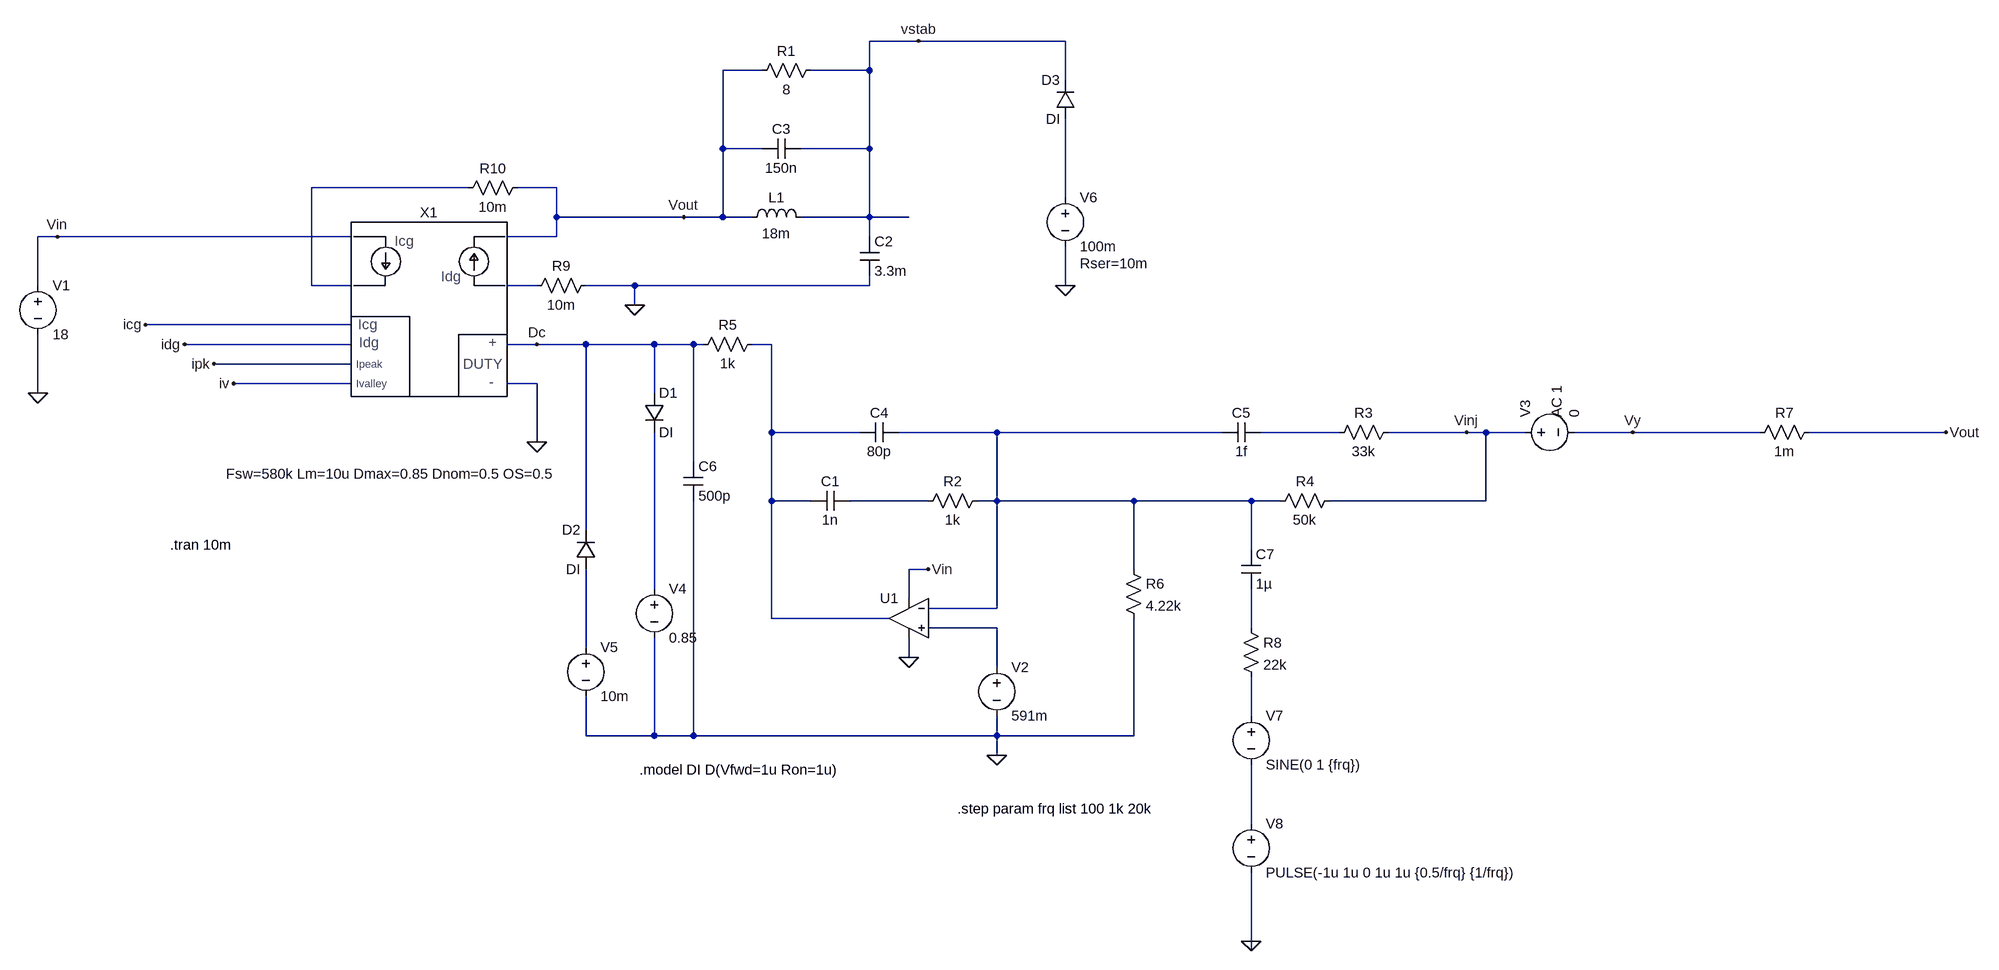
[diagram p0: schematic TPS40195_Power_Amp_Trans.asc]
TPS40195_Power_Amp_Trans.asc, the LTspice schematic file:
Version 4
SHEET 1 2744 1236
WIRE 992 -256 912 -256
WIRE 1232 -256 992 -256
WIRE 736 -208 672 -208
WIRE 912 -208 912 -256
WIRE 912 -208 816 -208
WIRE 1232 -192 1232 -256
WIRE 672 -80 672 -208
WIRE 736 -80 672 -80
WIRE 912 -80 912 -208
WIRE 912 -80 800 -80
WIRE 256 -16 0 -16
WIRE 400 -16 336 -16
WIRE 1232 0 1232 -128
WIRE 400 32 400 -16
WIRE 608 32 400 32
WIRE 672 32 672 -80
WIRE 672 32 608 32
WIRE 720 32 672 32
WIRE 912 32 912 -80
WIRE 912 32 800 32
WIRE 976 32 912 32
WIRE -416 64 -448 64
WIRE 64 64 -416 64
WIRE 400 64 400 32
WIRE 400 64 320 64
WIRE 912 64 912 32
WIRE -448 144 -448 64
WIRE 0 144 0 -16
WIRE 64 144 0 144
WIRE 368 144 320 144
WIRE 528 144 448 144
WIRE 912 144 912 128
WIRE 912 144 528 144
WIRE 1232 144 1232 80
WIRE 528 176 528 144
WIRE 64 208 -272 208
WIRE 64 240 -208 240
WIRE 368 240 320 240
WIRE 448 240 368 240
WIRE 560 240 448 240
WIRE 624 240 560 240
WIRE 640 240 624 240
WIRE 752 240 720 240
WIRE 64 272 -160 272
WIRE 64 304 -128 304
WIRE 368 304 320 304
WIRE -448 320 -448 224
WIRE 560 320 560 240
WIRE 752 384 752 240
WIRE 896 384 752 384
WIRE 1120 384 960 384
WIRE 1488 384 1120 384
WIRE 1680 384 1552 384
WIRE 1888 384 1760 384
WIRE 1920 384 1888 384
WIRE 1984 384 1920 384
WIRE 2160 384 2064 384
WIRE 2368 384 2160 384
WIRE 2672 384 2448 384
WIRE 368 400 368 304
WIRE 624 432 624 240
WIRE 752 496 752 384
WIRE 816 496 752 496
WIRE 1008 496 880 496
WIRE 1120 496 1120 384
WIRE 1120 496 1088 496
WIRE 1344 496 1120 496
WIRE 1536 496 1344 496
WIRE 1584 496 1536 496
WIRE 1920 496 1920 384
WIRE 1920 496 1664 496
WIRE 448 544 448 240
WIRE 1536 576 1536 496
WIRE 1008 608 976 608
WIRE 1344 608 1344 496
WIRE 560 640 560 384
WIRE 976 656 976 608
WIRE 1120 672 1120 496
WIRE 1120 672 1008 672
WIRE 752 688 752 496
WIRE 944 688 752 688
WIRE 1120 704 1008 704
WIRE 1536 704 1536 640
WIRE 448 736 448 608
WIRE 976 752 976 720
WIRE 1120 768 1120 704
WIRE 1536 848 1536 784
WIRE 448 880 448 816
WIRE 560 880 560 720
WIRE 560 880 448 880
WIRE 624 880 624 496
WIRE 624 880 560 880
WIRE 1120 880 1120 848
WIRE 1120 880 624 880
WIRE 1344 880 1344 688
WIRE 1344 880 1120 880
WIRE 1120 912 1120 880
WIRE 1536 1024 1536 928
WIRE 1536 1216 1536 1104
WIRE 1536 1232 1536 1216
FLAG 528 176 0
FLAG -448 320 0
FLAG 608 32 Vout
FLAG -416 64 Vin
FLAG 368 240 Dc
FLAG -272 208 icg
FLAG -208 240 idg
FLAG -160 272 ipk
FLAG -128 304 iv
FLAG 368 400 0
FLAG 976 752 0
FLAG 1008 608 Vin
FLAG 1120 912 0
FLAG 2672 384 Vout
FLAG 1888 384 Vinj
FLAG 1232 144 0
FLAG 2160 384 Vy
FLAG 1536 1216 0
FLAG 992 -256 vstab
DATAFLAG -208 208 ""
DATAFLAG -112 240 ""
DATAFLAG -112 272 ""
DATAFLAG -32 304 ""
DATAFLAG 464 32 ""
DATAFLAG 976 32 ""
DATAFLAG 480 240 ""
DATAFLAG 1200 384 ""
DATAFLAG 784 384 ""
SYMBOL voltage -448 128 R0
WINDOW 123 0 0 Left 0
WINDOW 39 0 0 Left 0
SYMATTR InstName V1
SYMATTR Value 18
SYMBOL Duty_Control_IRM 192 144 R0
WINDOW 39 -332 308 Left 2
SYMATTR SpiceLine Fsw=580k Lm=10u Dmax=0.85 Dnom=0.5 OS=0.5
SYMATTR InstName X1
SYMBOL ind 704 48 R270
WINDOW 0 32 56 VTop 2
WINDOW 3 5 56 VBottom 2
SYMATTR InstName L1
SYMATTR Value 18m
SYMATTR SpiceLine Rser=6
SYMBOL cap 896 64 R0
SYMATTR InstName C2
SYMATTR Value 3.3m
SYMATTR SpiceLine Rser=20m
SYMBOL cap 800 -96 R90
WINDOW 0 0 32 VBottom 2
WINDOW 3 32 32 VTop 2
SYMATTR InstName C3
SYMATTR Value 150n
SYMBOL res 832 -224 R90
WINDOW 0 0 56 VBottom 2
WINDOW 3 32 56 VTop 2
SYMATTR InstName R1
SYMATTR Value 8
SYMBOL Opamps\\UniversalOpamp2 976 688 M0
SYMATTR InstName U1
SYMATTR Value2 Avol=1k GBW=7Meg Slew=10Meg
SYMATTR SpiceLine ilimit=25m rail=0 Vos=0 phimargin=68
SYMBOL voltage 1120 752 R0
WINDOW 123 0 0 Left 0
WINDOW 39 0 0 Left 0
SYMATTR InstName V2
SYMATTR Value 591m
SYMBOL cap 880 480 R90
WINDOW 0 0 32 VBottom 2
WINDOW 3 32 32 VTop 2
SYMATTR InstName C1
SYMATTR Value 1n
SYMBOL res 1104 480 R90
WINDOW 0 0 56 VBottom 2
WINDOW 3 32 56 VTop 2
SYMATTR InstName R2
SYMATTR Value 1k
SYMBOL cap 960 368 R90
WINDOW 0 0 32 VBottom 2
WINDOW 3 32 32 VTop 2
SYMATTR InstName C4
SYMATTR Value 80p
SYMBOL cap 1552 368 R90
WINDOW 0 0 32 VBottom 2
WINDOW 3 32 32 VTop 2
SYMATTR InstName C5
SYMATTR Value 1f
SYMBOL res 1776 368 R90
WINDOW 0 0 56 VBottom 2
WINDOW 3 32 56 VTop 2
SYMATTR InstName R3
SYMATTR Value 33k
SYMBOL res 1680 480 R90
WINDOW 0 0 56 VBottom 2
WINDOW 3 32 56 VTop 2
SYMATTR InstName R4
SYMATTR Value 50k
SYMBOL res 736 224 R90
WINDOW 0 0 56 VBottom 2
WINDOW 3 32 56 VTop 2
SYMATTR InstName R5
SYMATTR Value 1k
SYMBOL res 1328 592 R0
SYMATTR InstName R6
SYMATTR Value 4.22k
SYMBOL voltage 1968 384 R270
WINDOW 123 24 68 Left 2
WINDOW 39 0 0 Left 0
SYMATTR Value2 AC 1
SYMATTR InstName V3
SYMATTR Value 0
SYMBOL diode 544 320 R0
SYMATTR InstName D1
SYMATTR Value DI
SYMBOL voltage 560 624 R0
WINDOW 123 0 0 Left 0
WINDOW 39 0 0 Left 0
SYMATTR InstName V4
SYMATTR Value 0.85
SYMBOL diode 464 608 R180
WINDOW 0 24 64 Left 2
WINDOW 3 24 0 Left 2
SYMATTR InstName D2
SYMATTR Value DI
SYMBOL voltage 448 720 R0
WINDOW 123 0 0 Left 0
WINDOW 39 0 0 Left 0
SYMATTR InstName V5
SYMATTR Value 10m
SYMBOL diode 1248 -128 R180
WINDOW 0 24 64 Left 2
WINDOW 3 24 0 Left 2
SYMATTR InstName D3
SYMATTR Value DI
SYMBOL voltage 1232 -16 R0
WINDOW 123 0 0 Left 0
WINDOW 39 24 124 Left 2
SYMATTR SpiceLine Rser=10m
SYMATTR InstName V6
SYMATTR Value 100m
SYMBOL res 2464 368 R90
WINDOW 0 0 56 VBottom 2
WINDOW 3 32 56 VTop 2
SYMATTR InstName R7
SYMATTR Value 1m
SYMBOL voltage 1536 832 R0
WINDOW 123 0 0 Left 0
WINDOW 39 0 0 Left 0
SYMATTR InstName V7
SYMATTR Value SINE(0 1 {frq})
SYMBOL cap 608 432 R0
SYMATTR InstName C6
SYMATTR Value 500p
SYMBOL cap 1520 576 R0
SYMATTR InstName C7
SYMATTR Value 1µ
SYMBOL res 1520 688 R0
SYMATTR InstName R8
SYMATTR Value 22k
SYMBOL res 464 128 R90
WINDOW 0 0 56 VBottom 2
WINDOW 3 32 56 VTop 2
SYMATTR InstName R9
SYMATTR Value 10m
SYMBOL res 352 -32 R90
WINDOW 0 0 56 VBottom 2
WINDOW 3 32 56 VTop 2
SYMATTR InstName R10
SYMATTR Value 10m
SYMBOL voltage 1536 1008 R0
WINDOW 123 0 0 Left 0
WINDOW 39 0 0 Left 0
SYMATTR InstName V8
SYMATTR Value PULSE(-1u 1u 0 1u 1u {0.5/frq} {1/frq})
TEXT -232 568 Left 2 !.tran 10m
TEXT 536 936 Left 2 !.model DI D(Vfwd=1u Ron=1u)
TEXT 1056 1000 Left 2 !.step param frq list 100 1k 20k

The netlist it stands for:
* TPS40195_Power_Amp_Trans.asc
V1 Vin 0 18
XX1 Dc 0 Vin N001 Vout N003 icg idg ipk iv Duty_Control_IRM params: Fsw=580k Lm=10u Dmax=0.85 Dnom=0.5 OS=0.5  ; pins D+ D- Vcg+ Vcg- Vdg+ Vdg- Icharge Idischarge Ipeak Ivalley
L1 Vout vstab 18m Rser=6
C2 vstab 0 3.3m Rser=20m
C3 vstab Vout 150n
R1 vstab Vout 8
XU1 N009 N005 Vin 0 N004 level.2 Avol=1k GBW=7Meg Slew=10Meg ilimit=25m rail=0 Vos=0 phimargin=68 en=0 enk=0 in=0 ink=0 Rin=500Meg  ; pins IN+ IN- V+ V- OUT
V2 N009 0 591m
C1 N007 N004 1n
R2 N005 N007 1k
C4 N005 N004 80p
C5 N006 N005 1f
R3 Vinj N006 33k
R4 Vinj N005 50k
R5 N004 Dc 1k
R6 N005 0 4.22k
V3 Vinj Vy 0 AC 1
D1 Dc N008 DI
V4 N008 0 0.85
D2 N011 Dc DI
V5 N011 0 10m
D3 N002 vstab DI
V6 N002 0 100m Rser=10m
R7 Vout Vy 1m
V7 N012 N013 SINE(0 1 {frq})
C6 Dc 0 500p
C7 N005 N010 1µ
R8 N010 N012 22k
R9 0 N003 10m
R10 Vout N001 10m
V8 N013 0 PULSE(-1u 1u 0 1u 1u {0.5/frq} {1/frq})
.model D D
.lib standard.dio
.tran 10m
.model DI D(Vfwd=1u Ron=1u)
.step param frq list 100 1k 20k
.lib UniversalOpamps2.sub
.backanno
.end